# Altium schematic sheet test.SchDoc
size A4
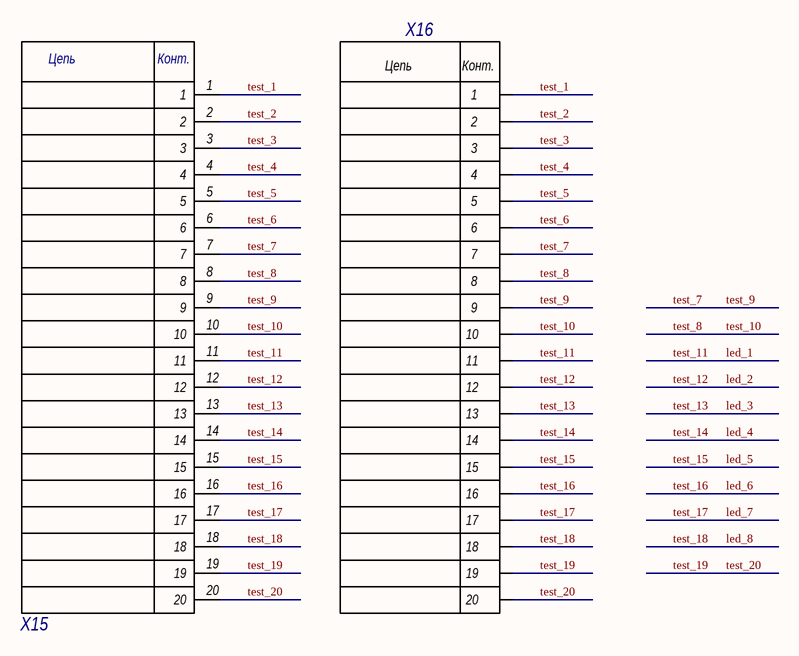
[diagram p0: test.SchDoc]

## Parts
X15  87831-2020  [87831-2020]  (value not drawn)
X16  PLD-20  [PLD-20]  (value not drawn)

## Nets
led_1: X15.11 X16.11  [also labelled test_11]
led_2: X15.12 X16.12  [also labelled test_12]
led_3: X15.13 X16.13  [also labelled test_13]
led_4: X15.14 X16.14  [also labelled test_14]
led_5: X15.15 X16.15  [also labelled test_15]
led_6: X15.16 X16.16  [also labelled test_16]
led_7: X15.17 X16.17  [also labelled test_17]
led_8: X15.18 X16.18  [also labelled test_18]
test_1: X15.1 X16.1
test_2: X15.2 X16.2
test_3: X15.3 X16.3
test_4: X15.4 X16.4
test_5: X15.5 X16.5
test_6: X15.6 X16.6
test_7: X15.7 X15.9 X16.7 X16.9  [also labelled test_9]
test_10: X15.8 X15.10 X16.8 X16.10  [also labelled test_8]
test_19: X15.19 X15.20 X16.19 X16.20  [also labelled test_20]

## Notes on the sheet
- (in symbol 87831-2020) Цепь; Конт.
- (in symbol PLD-20 2.54mm) Цепь; Конт.

## Library data of the parts
X15 = 87831-2020: CONN HEADER VERT 20POS 2MM; PartNumberFrom1C: Вилка Molex 87831-2020; Manufacturer: Molex; Код: 206; 1CType: Вилка; Extended Price: $6,864.65/5000; Minimum Quantity: 1; Number of Positions: 20; Number of Positions Loaded: All; Pitch - Mating: 0.079" (2.00mm); System: Connector; PartNumber: 87831-2020; PartNumberFrom1C_accuracy: Вилка Molex 87831-2020; OrderCode: 87831-2020; Unit Price: $2.64; Packaging: Tube; Series: Milli-Grid 87831; Contact Type: Male Pin; Number of Rows: 2; Row Spacing: 0.079" (2.00mm); Contact Mating Length: 0.141" (3.60mm); Mounting Type: Male Pin; Fastening Type: Latch Holder; Termination: Solder; Current Rating: -; Operating Temperature: -; Contact Finish: Gold; Contact Finish Thickness: 15.0µin (0.38µm); ComponentLink: https://www.digikey.com/product-detail/en/molex/0878312020/WM18564-ND/679682; ComponentLink1URL: https://www.digikey.com/product-detail/en/molex/0878312020/WM18564-ND/679682; ComponentLink1Description: Технические характеристики
X16 = PLD-20 2.54mm: штыри на плату двурядные; PartNumberFrom1C: Штырь PLD-20; Код: 27; 1CType: Штырь; Number of Positions: 20; Pitch - Mating: 2,54 мм; System: Connector; PartNumber: PLD-20 2.54mm; PartNumberFrom1C_accuracy: Штырь PLD-20; OrderCode: PLD-20; Mounting Type: Through Hole; ComponentLink1Description: Технические характеристики